# Altium schematic sheet obc-v2_CM4-PinOut.SchDoc
size 420 x 297 mm; SheetNumber: 16; SheetTotal: 23
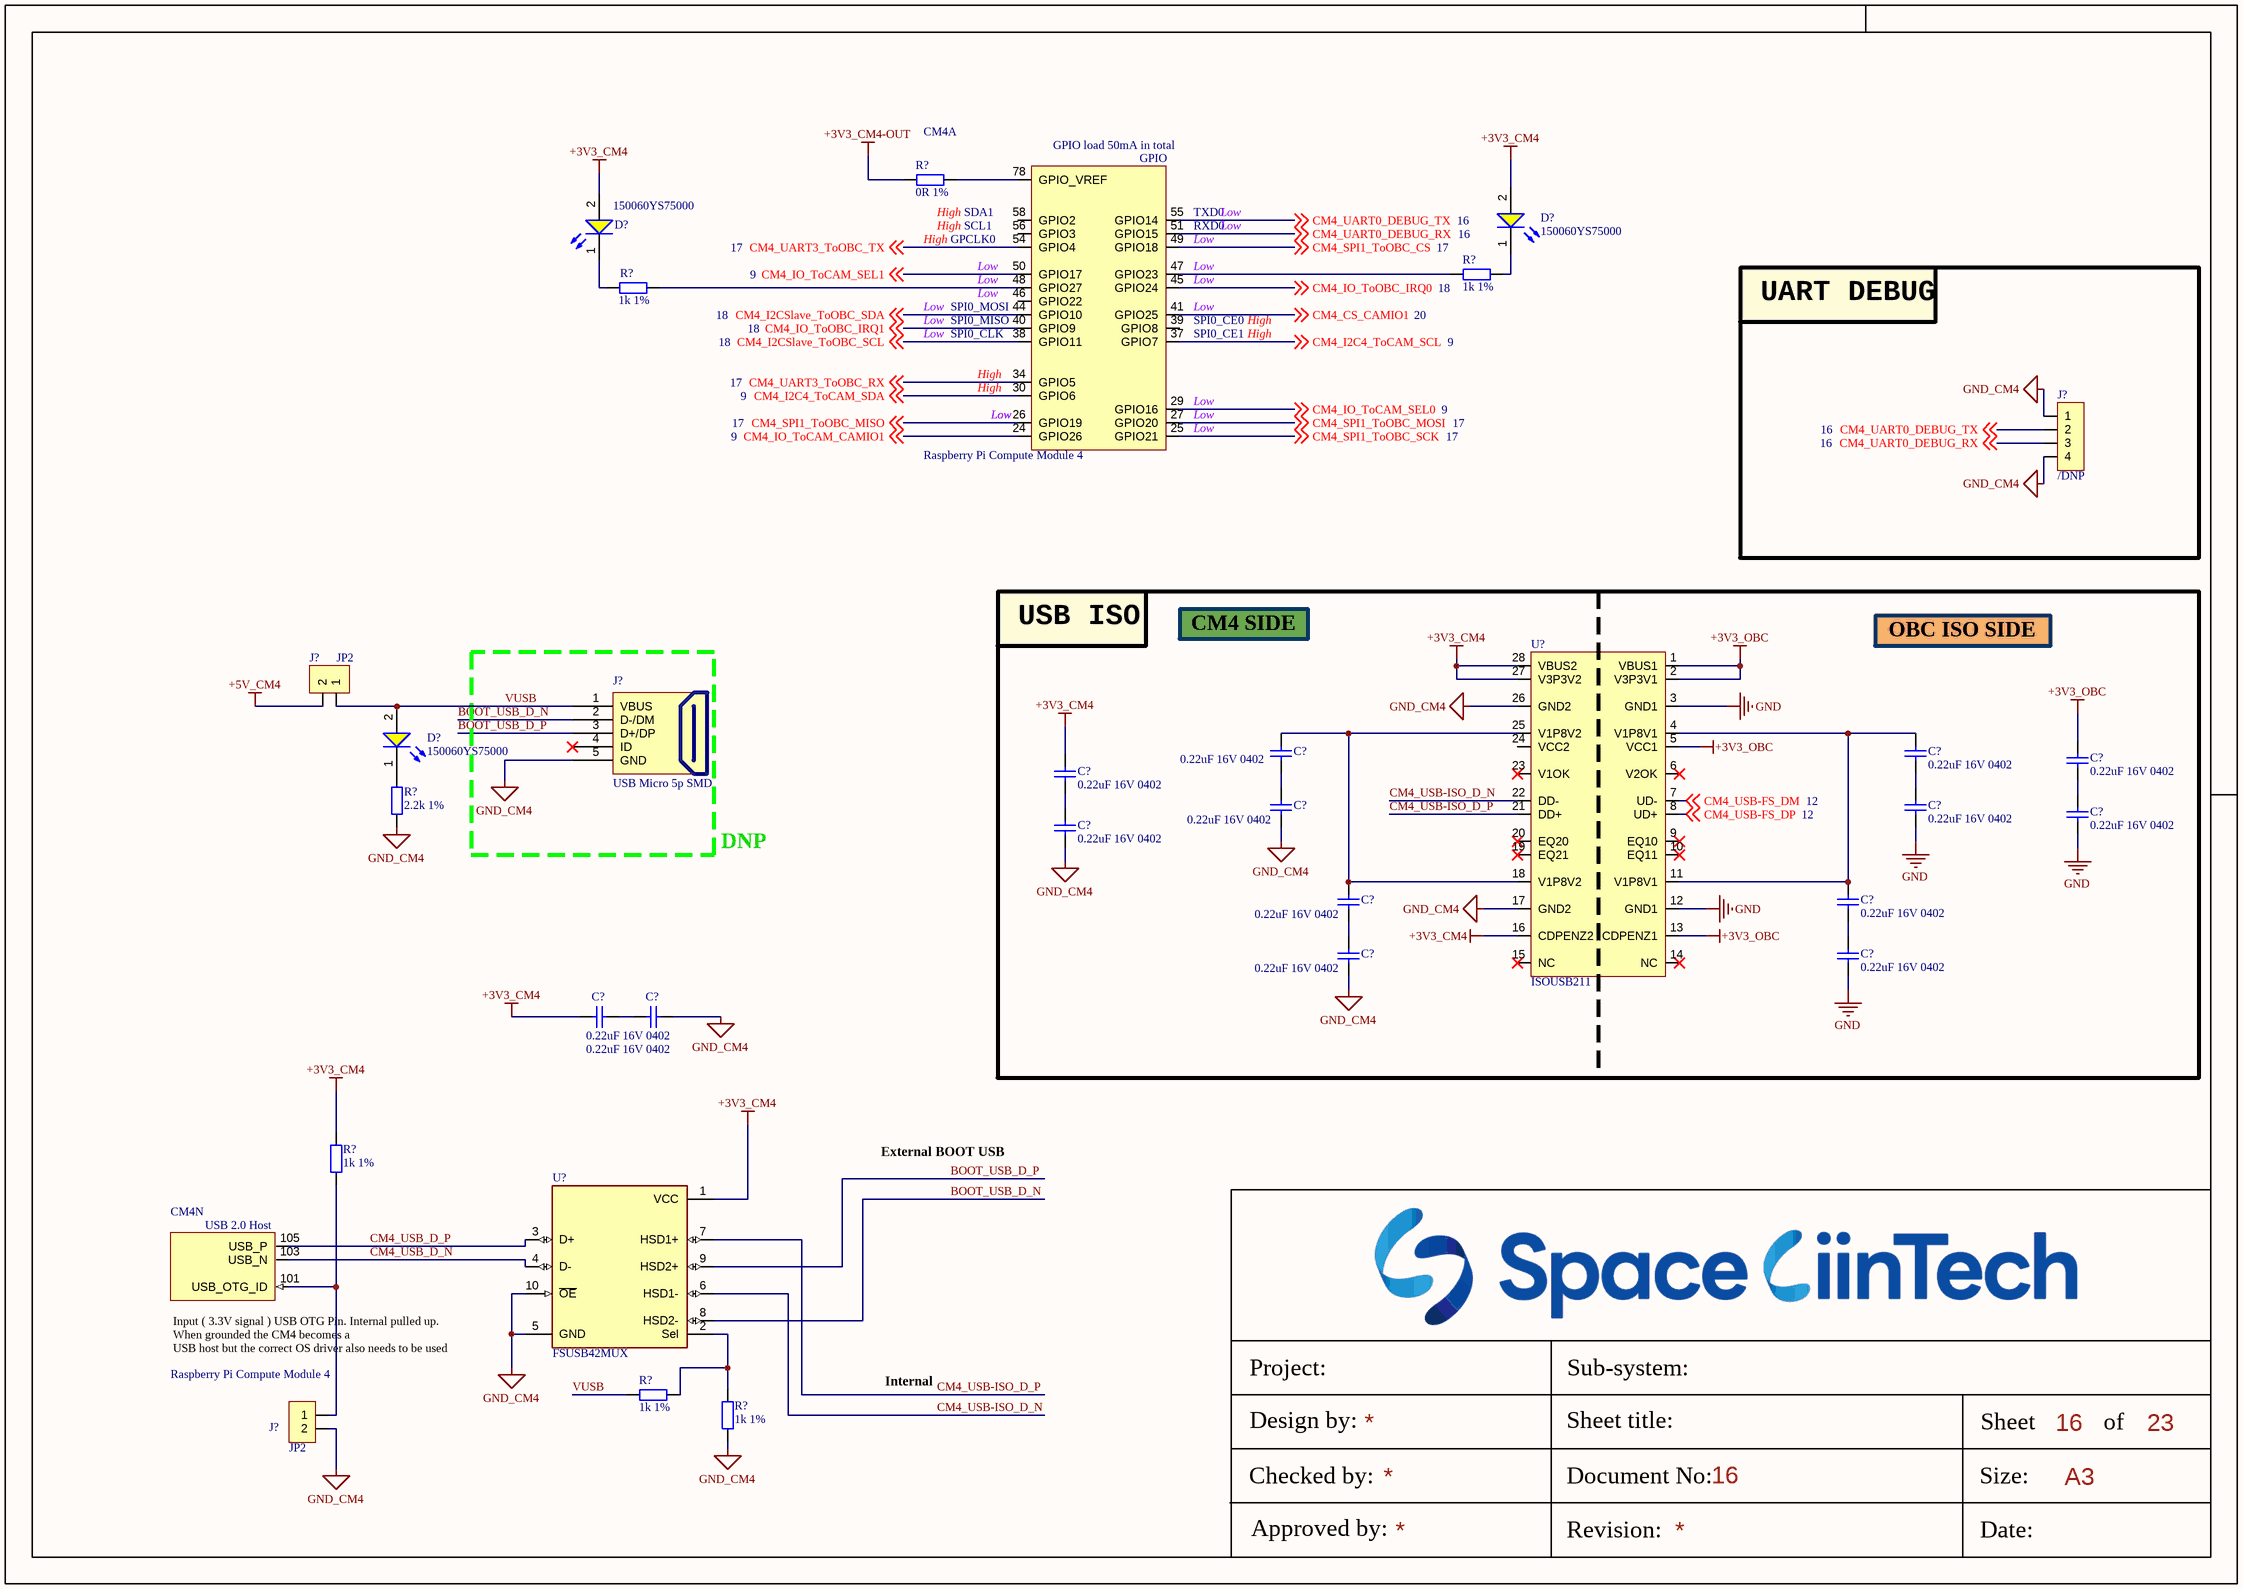
[diagram p0: obc-v2_CM4-PinOut.SchDoc]

## Parts
(Parts that share a designator on the sheet are numbered #1, #2 ... from top to bottom, then left to right.)
C?#1  0.22uF 16V 0402  [tu 0402]
C?#2  0.22uF 16V 0402  [tu 0402]
C?#3  0.22uF 16V 0402  [tu 0402]
C?#4  0.22uF 16V 0402  [tu 0402]
C?#5  0.22uF 16V 0402  [tu 0402]
C?#6  0.22uF 16V 0402  [tu 0402]
C?#7  0.22uF 16V 0402  [tu 0402]
C?#8  0.22uF 16V 0402  [tu 0402]
C?#9  0.22uF 16V 0402  [tu 0402]
C?#10  0.22uF 16V 0402  [tu 0402]
C?#11  0.22uF 16V 0402  [tu 0402]
C?#12  0.22uF 16V 0402  [tu 0402]
C?#13  0.22uF 16V 0402  [tu 0402]
C?#14  0.22uF 16V 0402  [tu 0402]
CM4  Raspberry Pi Compute Module 4  [CM4-DF40HC(3.0)-100DS-0.4v_3mm_1.5mm]  (parts A,N of 21)  (no BOM)
D?#1  150060YS75000  [WL-SMCW_0603_150060xx75000]
D?#2  150060YS75000  [WL-SMCW_0603_150060xx75000]
D?#3  150060YS75000  [WL-SMCW_0603_150060xx75000]
J?#1  /DNP  [JP4-C1T]
J?#2  JP2  [JP2-D1T]
J?#3  USB Micro 5p SMD  [USB Micro 5p SMD]
J?#4  JP2  [JP2-D1T]
R?#1  0R 1%  [tro smd 0603]
R?#2  1k 1%  [tro smd 0603]
R?#3  1k 1%  [tro smd 0603]
R?#4  2.2k 1%  [tro smd 0603]
R?#5  1k 1%  [tro smd 0603]
R?#6  1k 1%  [tro smd 0603]
R?#7  1k 1%  [tro smd 0603]
U?#1  ISOUSB211
U?#2  FSUSB42MUX  [FP-846AP-MFG]

## Blocks framed on the sheet
UART DEBUG: J?#1
USB ISO: C?#1-C?#12 U?#1

## Nets
+3V3_CM4: C?#4.1 C?#13.1 D?#1.2(A) D?#2.2(A) R?#5.1 U?#1.16(CDPENZ2) U?#1.27(V3P3V2) U?#1.28(VBUS2) U?#2.1(VCC)
+3V3_CM4-OUT: R?#1.1
+3V3_OBC: C?#3.1 U?#1.1(VBUS1) U?#1.2(V3P3V1) U?#1.5(VCC1) U?#1.13(CDPENZ1)
+5V_CM4: J?#2.2
GND: C?#6.2 C?#7.2 C?#12.2 U?#1.3(GND1) U?#1.12(GND1)
GND_CM4: C?#5.2 C?#8.2 C?#11.2 C?#14.2 J?#1.1 J?#1.4 J?#3.5(GND) J?#4.2 R?#4.2 R?#7.2 U?#1.17(GND2) U?#1.26(GND2) U?#2.5(GND) U?#2.10(~{OE})
BOOT_USB_D_N: J?#3.2(D-/DM) U?#2.8(HSD2-)
BOOT_USB_D_P: J?#3.3(D+/DP) U?#2.9(HSD2+)
CM4_CS_CAMIO1: CM4.41(GPIO25) ; off-sheet CM4_CS_CAMIO1
CM4_I2C4_ToCAM_SCL: CM4.37(GPIO7) ; off-sheet CM4_I2C4_ToCAM_SCL
CM4_I2C4_ToCAM_SDA: CM4.30(GPIO6) ; off-sheet CM4_I2C4_ToCAM_SDA
CM4_I2CSlave_ToOBC_SCL: CM4.38(GPIO11) ; off-sheet CM4_I2CSlave_ToOBC_SCL
CM4_I2CSlave_ToOBC_SDA: CM4.44(GPIO10) ; off-sheet CM4_I2CSlave_ToOBC_SDA
CM4_IO_ToCAM_CAMIO1: CM4.24(GPIO26) ; off-sheet CM4_IO_ToCAM_CAMIO1
CM4_IO_ToCAM_SEL0: CM4.29(GPIO16) ; off-sheet CM4_IO_ToCAM_SEL0
CM4_IO_ToCAM_SEL1: CM4.50(GPIO17) ; off-sheet CM4_IO_ToCAM_SEL1
CM4_IO_ToOBC_IRQ0: CM4.45(GPIO24) ; off-sheet CM4_IO_ToOBC_IRQ0
CM4_IO_ToOBC_IRQ1: CM4.40(GPIO9) ; off-sheet CM4_IO_ToOBC_IRQ1
CM4_SPI1_ToOBC_CS: CM4.49(GPIO18) ; off-sheet CM4_SPI1_ToOBC_CS
CM4_SPI1_ToOBC_MISO: CM4.26(GPIO19) ; off-sheet CM4_SPI1_ToOBC_MISO
CM4_SPI1_ToOBC_MOSI: CM4.27(GPIO20) ; off-sheet CM4_SPI1_ToOBC_MOSI
CM4_SPI1_ToOBC_SCK: CM4.25(GPIO21) ; off-sheet CM4_SPI1_ToOBC_SCK
CM4_UART0_DEBUG_RX: CM4.51(GPIO15) J?#1.3 ; off-sheet CM4_UART0_DEBUG_RX
CM4_UART0_DEBUG_TX: CM4.55(GPIO14) J?#1.2 ; off-sheet CM4_UART0_DEBUG_TX
CM4_UART3_ToOBC_RX: CM4.34(GPIO5) ; off-sheet CM4_UART3_ToOBC_RX
CM4_UART3_ToOBC_TX: CM4.54(GPIO4) ; off-sheet CM4_UART3_ToOBC_TX
CM4_USB-FS_DM: U?#1.7(UD-) ; off-sheet CM4_USB-FS_DM
CM4_USB-FS_DP: U?#1.8(UD+) ; off-sheet CM4_USB-FS_DP
CM4_USB-ISO_D_N: U?#1.22(DD-) U?#2.6(HSD1-)
CM4_USB-ISO_D_P: U?#1.21(DD+) U?#2.7(HSD1+)
CM4_USB_D_N: CM4.103(USB_N) U?#2.4(D-)
CM4_USB_D_P: CM4.105(USB_P) U?#2.3(D+)
VUSB: D?#3.2(A) J?#2.1 J?#3.1(VBUS) R?#6.1
NetC?#1_1: C?#1.1 C?#9.1 U?#1.18(V1P8V2) U?#1.25(V1P8V2)
NetC?#1_2: C?#1.2 C?#5.1
NetC?#2_1: C?#2.1 C?#10.1 U?#1.4(V1P8V1) U?#1.11(V1P8V1)
NetC?#2_2: C?#2.2 C?#6.1
NetC?#3_2: C?#3.2 C?#7.1
NetC?#4_2: C?#4.2 C?#8.1
NetC?#9_2: C?#9.2 C?#11.1
NetC?#10_2: C?#10.2 C?#12.1
NetC?#13_2: C?#13.2 C?#14.1
NetCM4_47: CM4.47(GPIO23) R?#2.2
NetCM4_48: CM4.48(GPIO27) R?#3.2
NetCM4_78: CM4.78(GPIO_VREF) R?#1.2
NetCM4_101: CM4.101(USB_OTG_ID) J?#4.1 R?#5.2
NetD?#1_1: D?#1.1(K) R?#2.1
NetD?#2_1: D?#2.1(K) R?#3.1
NetD?#3_1: D?#3.1(K) R?#4.1
NetR?#6_2: R?#6.2 R?#7.1 U?#2.2(Sel)

Not connected (* = marked no-connect by the designer): CM4 39(GPIO8) 46(GPIO22) 56(GPIO3) 58(GPIO2); J?#3 4(ID)*; U?#1 6(V2OK)* 9(EQ10)* 10(EQ11)* 14(NC)* 15(NC)* 19(EQ21)* 20(EQ20)* 23(V1OK)* 24(VCC2)

## Notes on the sheet
- CM4 SIDE
- OBC ISO SIDE
- DNP
- External BOOT USB
- Internal
- Project:
- Sub-system:
- Design by:
- Sheet title:
- Sheet
- A3
- of
- Checked by:
- Approved by:
- Revision:
- Document No:
- Size:
- Date:
- (in symbol CM4, part A) GPIO load 50mA in total; GPIO; High; SDA1; TXD0; Low; SCL1; RXD0; GPCLK0; SPI0_MOSI; SPI0_MISO; SPI0_CE0; SPI0_CLK; SPI0_CE1; by Amornthep Phunsin
- (in symbol CM4, part N) USB 2.0 Host; Input ( 3.3V signal ) USB OTG Pin. Internal pulled up. When grounded the CM4 becomes a / USB host but the correct OS driver also needs to be used

## Library data of the parts
C?#1-C?#14 = Tu 0402 33nF 10V: 0.22 µF ±10% 16V Ceramic Capacitor X7R 0402 (1005 Metric): GCM155R71C224KE02D; Chung_Loai: Dán; Don_Vi: Con; So_Chan: 2; Ten_Linh_Kien: Tụ 0402 33nF X7R 10V GRM155R71A333KA01D; Ma_Hang: MH007853; Kieu_Chan: *
CM4 = CM4: Raspberry Pi Compute Module 4 by Amornthep Phunsin
D?#1-D?#3 = CMP-1426-00005-2: LED YELLOW CLEAR 0603 SMD; NexarPartId: 29687085; Wavelength: 590nm; Luminous Intensity: 120mcd; Peak Wavelength: 595nm; Forward Current: 100mA; Power Dissipation: 72mW; Forward Voltage: 2V; Test Current: 20mA; Reverse Voltage: 5V; Lens Style: Clear, Rectangular; Max Junction Temperature (Tj): 95°C; Viewing Angle: 140°; Case Code (Imperial): 0603; Height: 700µm; REACH SVHC: Unknown; Dominant Wavelength: 590nm; Min Operating Temperature: -40°C; Color: Yellow; Width: 800µm; Mount: Surface Mount; Packaging: Tape and Reel; Max Operating Temperature: 85°C; RoHS: Compliant; Max Reverse Voltage (DC): 5V; Case Code (Metric): 1608; Length: 1.6mm; Case/Package: 0603
J?#1 = JP4: WR-PHD 2.54 mm Angled Socket Header; Manufacturer: W¨¹rth Elektronik eiSos GmbH; partNo: 613004143121; ComponentLink1 Description: Manufacturer; ComponentLink2 Description: Datasheet; NoPins: 04; Created Date: 29 March 2013; ComponentLink1URL: http://www.we-online.com; ComponentLink2URL: http://katalog.we-online.de/em/datasheet/6130xx143121.pdf; Created by: Karrer Zheng
J?#2 J?#4 = JP2: WR-PHD 2.54 mm Angled Socket Header; Manufacturer: W¨¹rth Elektronik eiSos GmbH; partNo: 613002143121; ComponentLink1 Description: Manufacturer; ComponentLink2 Description: Datasheet; NoPins: 02; Created Date: 29 March 2013; ComponentLink1URL: http://www.we-online.com; ComponentLink2URL: http://katalog.we-online.de/em/datasheet/6130xx143121.pdf; Created by: Karrer Zheng
J?#3 = USB Micro 5p SMD: USB Type B; Ten: MicroUSB MK5P SMD; Ma_Hang: MH001020
R?#1 = Tro 0603 1% 10k: RES 4.7K OHM 1% 1/10W 0603, P/N: ERJ-U03F4701V; Chung_Loai: Dán; Don_Vi: Con; So_Chan: 2; Ten_Linh_Kien: Trở 0603 1% 10k; Ma_Hang: MH006333; Kieu_Chan: *
R?#2-R?#7 = Tro 0603 1% 10k: RES SMD 2.2K OHM 1% 1/10W 0603, P/N: ERJ-3EKF2201V; Chung_Loai: Dán; Don_Vi: Con; So_Chan: 2; Ten_Linh_Kien: Trở 0603 1% 10k; Ma_Hang: MH006333; Kieu_Chan: *
U?#2 = CMP-07103-000004-1: IC USB SWITCH DPDT 10MSOP; Voltage: 4.3V; Current: 100mA; Number of Inputs: 2; Supply Type: Single; Number of Outputs: 4; Data Rate: 480Mbps; On-State Resistance: 6.5R; Min Supply Voltage: 3V; Package Quantity: 1; Length: 3mm; Radiation Hardening: No; Number of Pins: 10; Width: 3mm; Number of Channels: 2; REACH SVHC: No SVHC; Lead Free: Lead Free; Max Operating Temperature: 85°C; Min Operating Temperature: -40°C; Packaging: Tape and Reel; Throw Configuration: DPDT; Operating Supply Voltage: 4.3V; Max Supply Voltage: 4.3V; Mount: Surface Mount; Case/Package: MSOP; Weight: 0.1125g; Height: 0.85mm